# EAGLE design PAYLOAD (EAGLE 9.6.2)
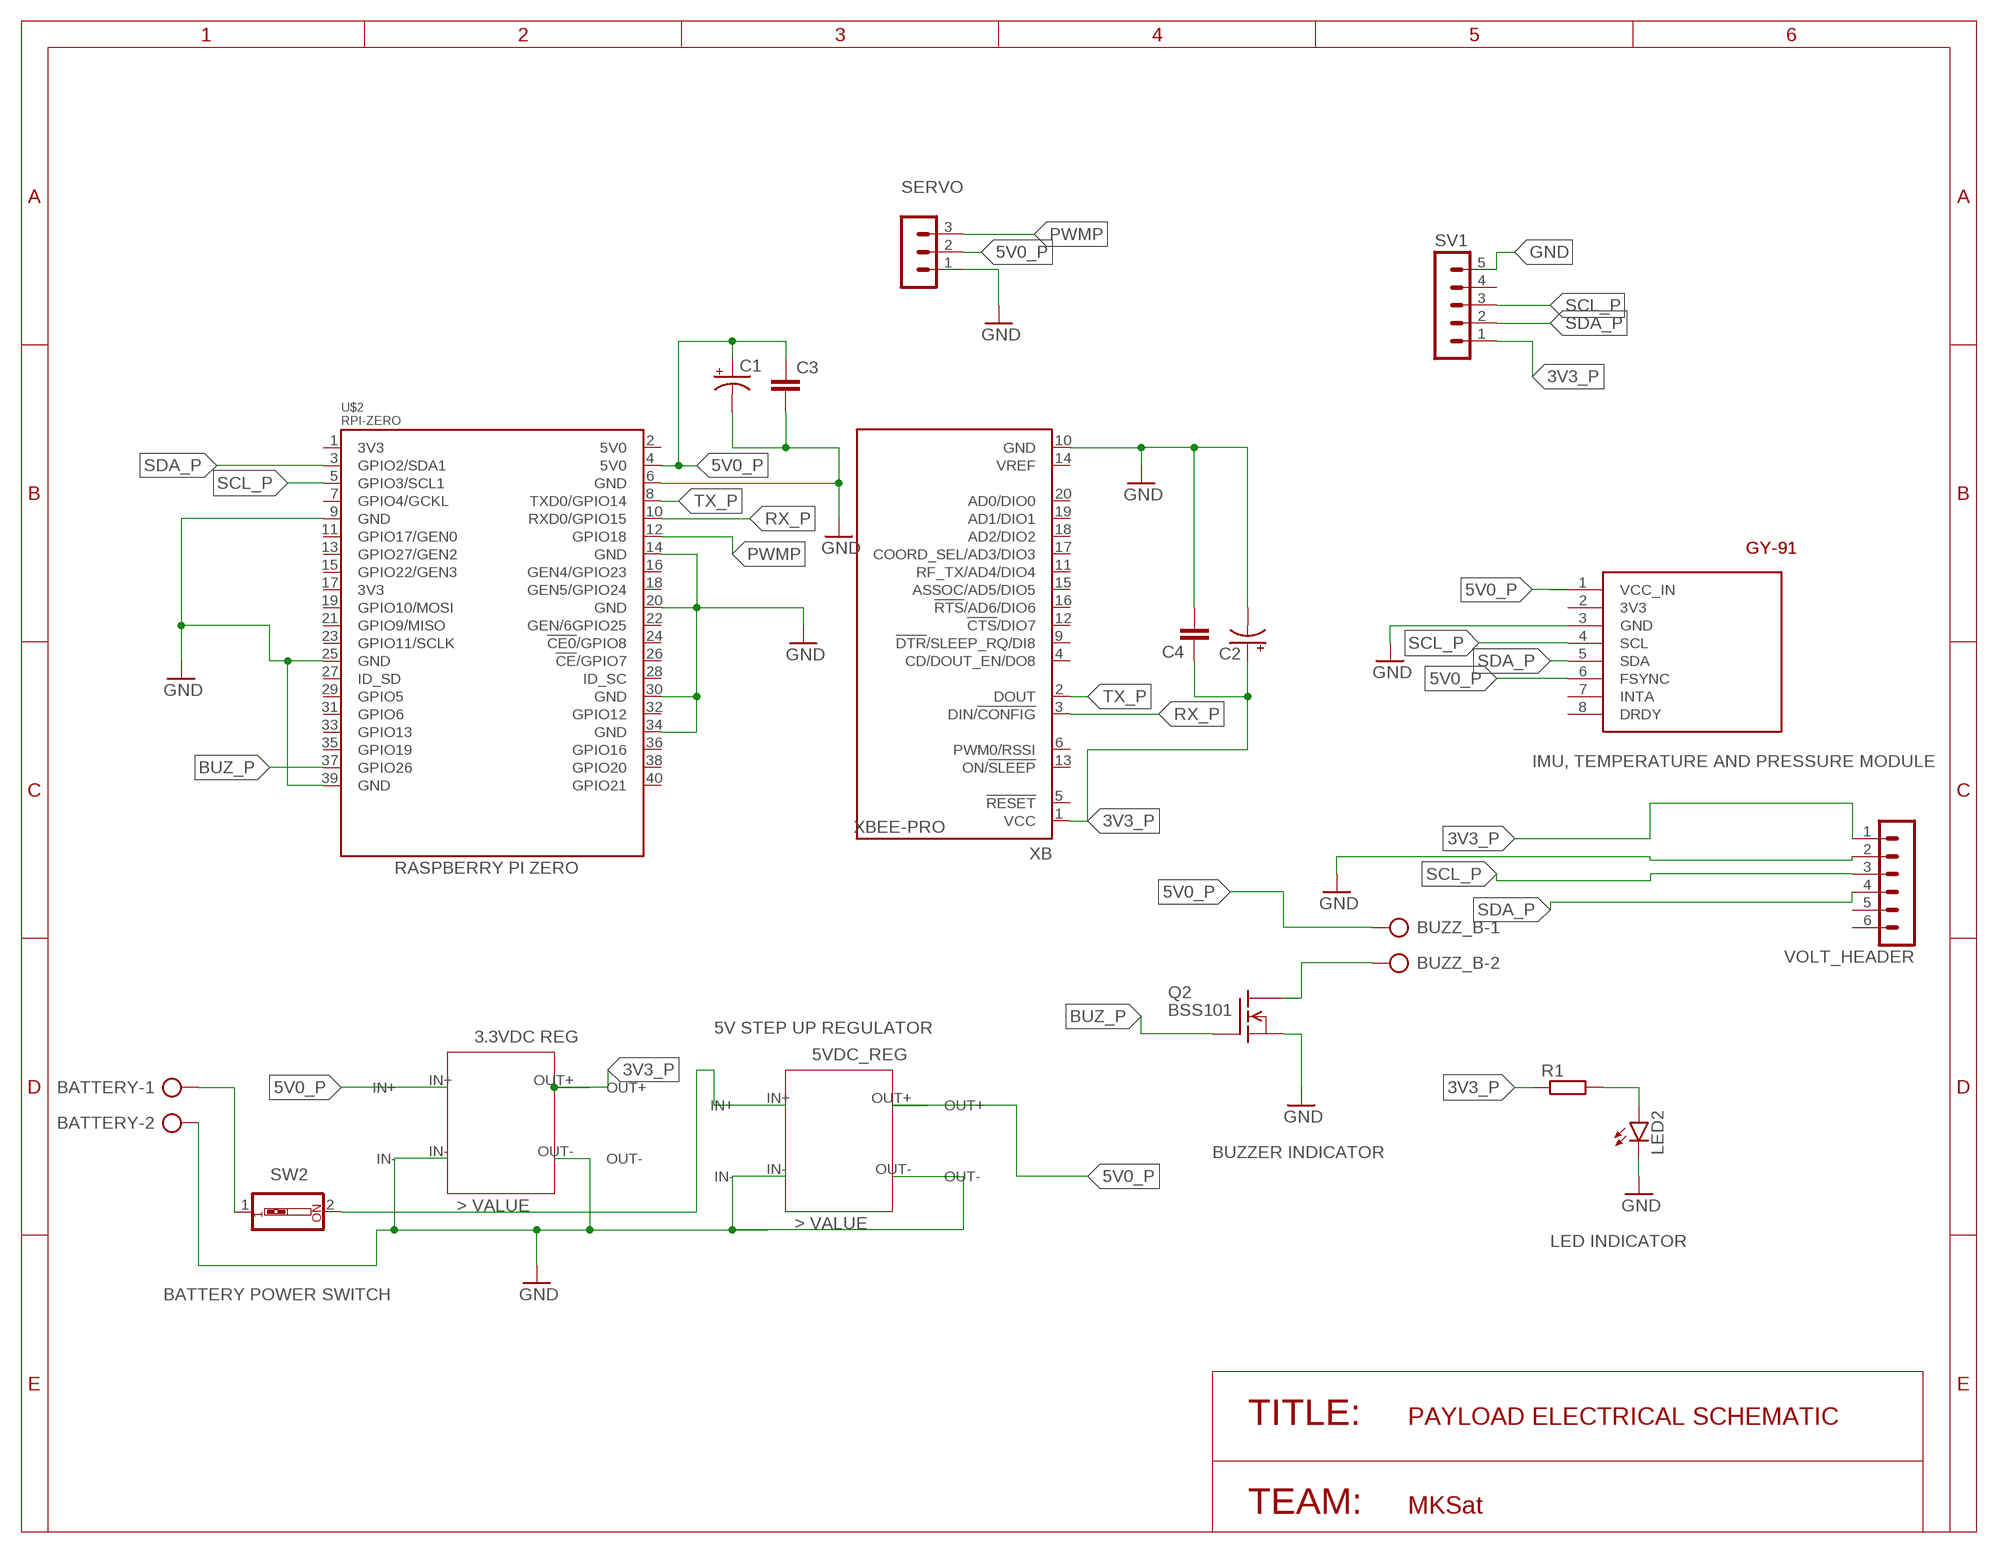
[diagram p0: schematic, sheet 1]

## Parts
BATTERY  AK500/2  [AK500/2]
BUZZ_B  AK500/2  [AK500/2]
C1  CPOL-USTAP5-45  [TAP5-45]
C2  CPOL-USTAP5-45  [TAP5-45]
C3  C-EU050-030X075  [C050-030X075]
C4  C-EU050-030X075  [C050-030X075]
GY-91_P  GY-86  [GY-86]
LED2  LED5MM  [LED5MM]
Q2  BSS101  [TO92]
R1  R-EU_0207/12  [0207/12]
SERVO  MA03-1  [MA03-1]
SV1  MA05-1  [MA05-1]
SW2  SW_DIP-1  [EDG-01]
U$1  3VDC_REG  [3VDC_REG]
U$2  RPI-ZERO  [RASPBERRYPI_BASTELSTUBE_V13_RASPI_BOARD_B+_FULL]
U$3  5VDC_REG  [5VDC_REG]
VOLT_HEADER  MA06-1  [MA06-1]
XB  XBEE-PRO  [XBEE-PRO]

## Nets
3V3_P: C2.+ C4.1 R1.1 SV1.1 U$1.OUT+ VOLT_HEADER.1 XB.1(VCC)
5V0_P: BUZZ_B.1 C1.+ C3.1 GY-91_P.1(VCC_IN) GY-91_P.6(FSYNC) SERVO.2 U$1.IN+ U$2.4(5V0) U$3.OUT+
BUZ_P: Q2.2(G) U$2.37(GPIO26)
GND: BATTERY.2 C1.- C2.- C3.2 C4.2 GY-91_P.3(GND) LED2.K(C) Q2.1(S) SERVO.1 SV1.5 U$1.IN- U$1.OUT- U$2.6(GND) U$2.9(GND) U$2.14(GND) U$2.20(GND) U$2.25(GND) U$2.30(GND) U$2.34(GND) U$2.39(GND) U$3.IN- U$3.OUT- VOLT_HEADER.2 XB.10(GND)
N$1: BUZZ_B.2 Q2.3(D)
N$2: SW2.2 U$3.IN+
N$3: BATTERY.1 SW2.1
N$11: LED2.A R1.2
PWMP: SERVO.3 U$2.12(GPIO18)
RX_P: U$2.10(RXD0/GPIO15) XB.3(DIN/!CONFIG)
SCL_P: GY-91_P.4(SCL) SV1.3 U$2.5(GPIO3/SCL1) VOLT_HEADER.3
SDA_P: GY-91_P.5(SDA) SV1.2 U$2.3(GPIO2/SDA1) VOLT_HEADER.4
TX_P: U$2.8(TXD0/GPIO14) XB.2(DOUT)
Unconnected: GY-91_P.2(3V3) GY-91_P.7(INTA) GY-91_P.8(DRDY) SV1.4 U$2.1(3V3) U$2.2(5V0) U$2.7(GPIO4/GCKL) U$2.11(GPIO17/GEN0) U$2.13(GPIO27/GEN2) U$2.15(GPIO22/GEN3) U$2.16(GEN4/GPIO23) U$2.17(3V3) U$2.18(GEN5/GPIO24) U$2.19(GPIO10/MOSI) U$2.21(GPIO9/MISO) U$2.22(GEN/6GPIO25) U$2.23(GPIO11/SCLK) U$2.24(!CE0!/GPIO8) U$2.26(!CE!/GPIO7) U$2.27(ID_SD) U$2.28(ID_SC) U$2.29(GPIO5) U$2.31(GPIO6) U$2.32(GPIO12) U$2.33(GPIO13) U$2.35(GPIO19) U$2.36(GPIO16) U$2.38(GPIO20) U$2.40(GPIO21) VOLT_HEADER.5 VOLT_HEADER.6 XB.4(CD/DOUT_EN/DO8) XB.5(!RESET) XB.6(PWM0/RSSI) XB.9(!DTR!/SLEEP_RQ/DI8) XB.11(RF_TX/AD4/DIO4) XB.12(!CTS!/DIO7) XB.13(ON/!SLEEP) XB.14(VREF) XB.15(ASSOC/AD5/DIO5) XB.16(!RTS!/AD6/DIO6) XB.17(COORD_SEL/AD3/DIO3) XB.18(AD2/DIO2) XB.19(AD1/DIO1) XB.20(AD0/DIO0)

## Notes on the sheet
- GY-91 | GY-91
- IMU, TEMPERATURE AND PRESSURE MODULE
- RASPBERRY PI ZERO
- 5V STEP UP REGULATOR
- BUZZER INDICATOR
- LED INDICATOR
- BATTERY POWER SWITCH
- TITLE: | PAYLOAD ELECTRICAL SCHEMATIC
- TEAM: | MKSat

## Library data of the parts
BATTERY BUZZ_B = con-ptr500:AK500/2: CONNECTOR; OC_FARNELL: unknown; OC_NEWARK: unknown
C1 C2 = rcl:CPOL-US: POLARIZED CAPACITOR, American symbol; SPICEPREFIX: C
C3 C4 = rcl:C-EU: CAPACITOR, European symbol; SPICEPREFIX: C
GY-91_P = GY_Boards:GY-86
LED2 = led:LED: LED OSRAM: - CHIPLED LG R971, LG N971, LY N971, LG Q971, LY Q971, LO R971, LY R971 LH N974, LH R974 LS Q976, LO Q976, LY Q976 LO Q996 - Hyper CHIPLED LW Q18S LB Q993, LB Q99A, LB R99A - SideLED LS A670, LO A670, LY A670, LG A670, LP A670 LB A673, LV A673, LT A673, LW A673 LH A674 LY A675 LS A676, LA A676, LO A676, LY A676, LW A676 LS A679, LY A679, LG A679 - Hyper Micro SIDELED® LS Y876, LA Y876, LO Y876, LY Y876 LT Y87S - SmartLED LW L88C, LW L88S LB L89C, LB L89S, LG L890 LS L89K, LO L89K, LY L89K LS L896, LA L896, LO L896, LY L896 - TOPLED LS T670, LO T670, LY T670, LG T670, LP T670 LSG T670, LSP T670, LSY T670, LOP T670, LYG T670 LG T671, LOG T671, LSG T671 LB T673, LV T673, LT T673, LW T673 LH T674 LS T676, LA T676, LO T676, LY T676, LB T676, LH T676, LSB T676, LW T676 LB T67C, LV T67C, LT T67C, LS T67K, LO T67K, LY T67K, LW E67C LS E67B, LA E67B, LO E67B, LY E67B, LB E67C, LV E67C, LT E67C LW T67C LS T679, LY T679, LG T679 LS T770, LO T770, LY T770, LG T770, LP T770 LB T773, LV T773, LT T773, LW T773 LH T774 LS E675, LA E675, LY E675, LS T675 LS T776, LA T776, LO T776, LY T776, LB T776 LHGB T686 LT T68C, LB T68C - Hyper Mini TOPLED® LB M676 - Mini TOPLED Santana® LG M470 LS M47K, LO M47K, LY M47K Source: http://www.osram.convergy.de LUXEON: - LUMILED® LXK2-PW12-R00, LXK2-PW12-S00, LXK2-PW14-U00, LXK2-PW14-V00 LXK2-PM12-R00, LXK2-PM12-S00, LXK2-PM14-U00 LXK2-PE12-Q00, LXK2-PE12-R00, LXK2-PE12-S00, LXK2-PE14-T00, LXK2-PE14-U00 LXK2-PB12-K00, LXK2-PB12-L00, LXK2-PB12-M00, LXK2-PB14-N00, LXK2-PB14-P00, LXK2-PB14-Q00 LXK2-PR12-L00, LXK2-PR12-M00, LXK2-PR14-Q00, LXK2-PR14-R00 LXK2-PD12-Q00, LXK2-PD12-R00, LXK2-PD12-S00 LXK2-PH12-R00, LXK2-PH12-S00 LXK2-PL12-P00, LXK2-PL12-Q00, LXK2-PL12-R00 Source: www.luxeon.com KINGBRIGHT: KA-3528ASYC Source: www.kingbright.com
Q2 = transistor-fet:BSS101: N-Channel Enhancement MOSFET 200V; 0,16A; 11Ohm
R1 = rcl:R-EU_: RESISTOR, European symbol; SPICEPREFIX: R
SERVO = con-lstb:MA03-1: PIN HEADER; OC_FARNELL: unknown; OC_NEWARK: unknown
SV1 = con-lstb:MA05-1: PIN HEADER; OC_FARNELL: unknown; OC_NEWARK: unknown
SW2 = special:SW_DIP-1: DIP SWITCH
U$1 = VOLTAGE_REGULATORS_CANSAT:3VDC_REG
U$2 = RPI-Zero:RPI-ZERO
U$3 = VOLTAGE_REGULATORS_CANSAT:5VDC_REG
VOLT_HEADER = con-lstb:MA06-1: PIN HEADER; OC_FARNELL: unknown; OC_NEWARK: unknown
XB = maxstream:XBEE: XBee (TM) /XBee-PRO(TM) OEM RF Modules Source: MaxStream, Inc. xbee_productmanual.pdf; MPN: XBP24-AWI-001; OC_FARNELL: 1337916; OC_NEWARK: 42M2667

## Board
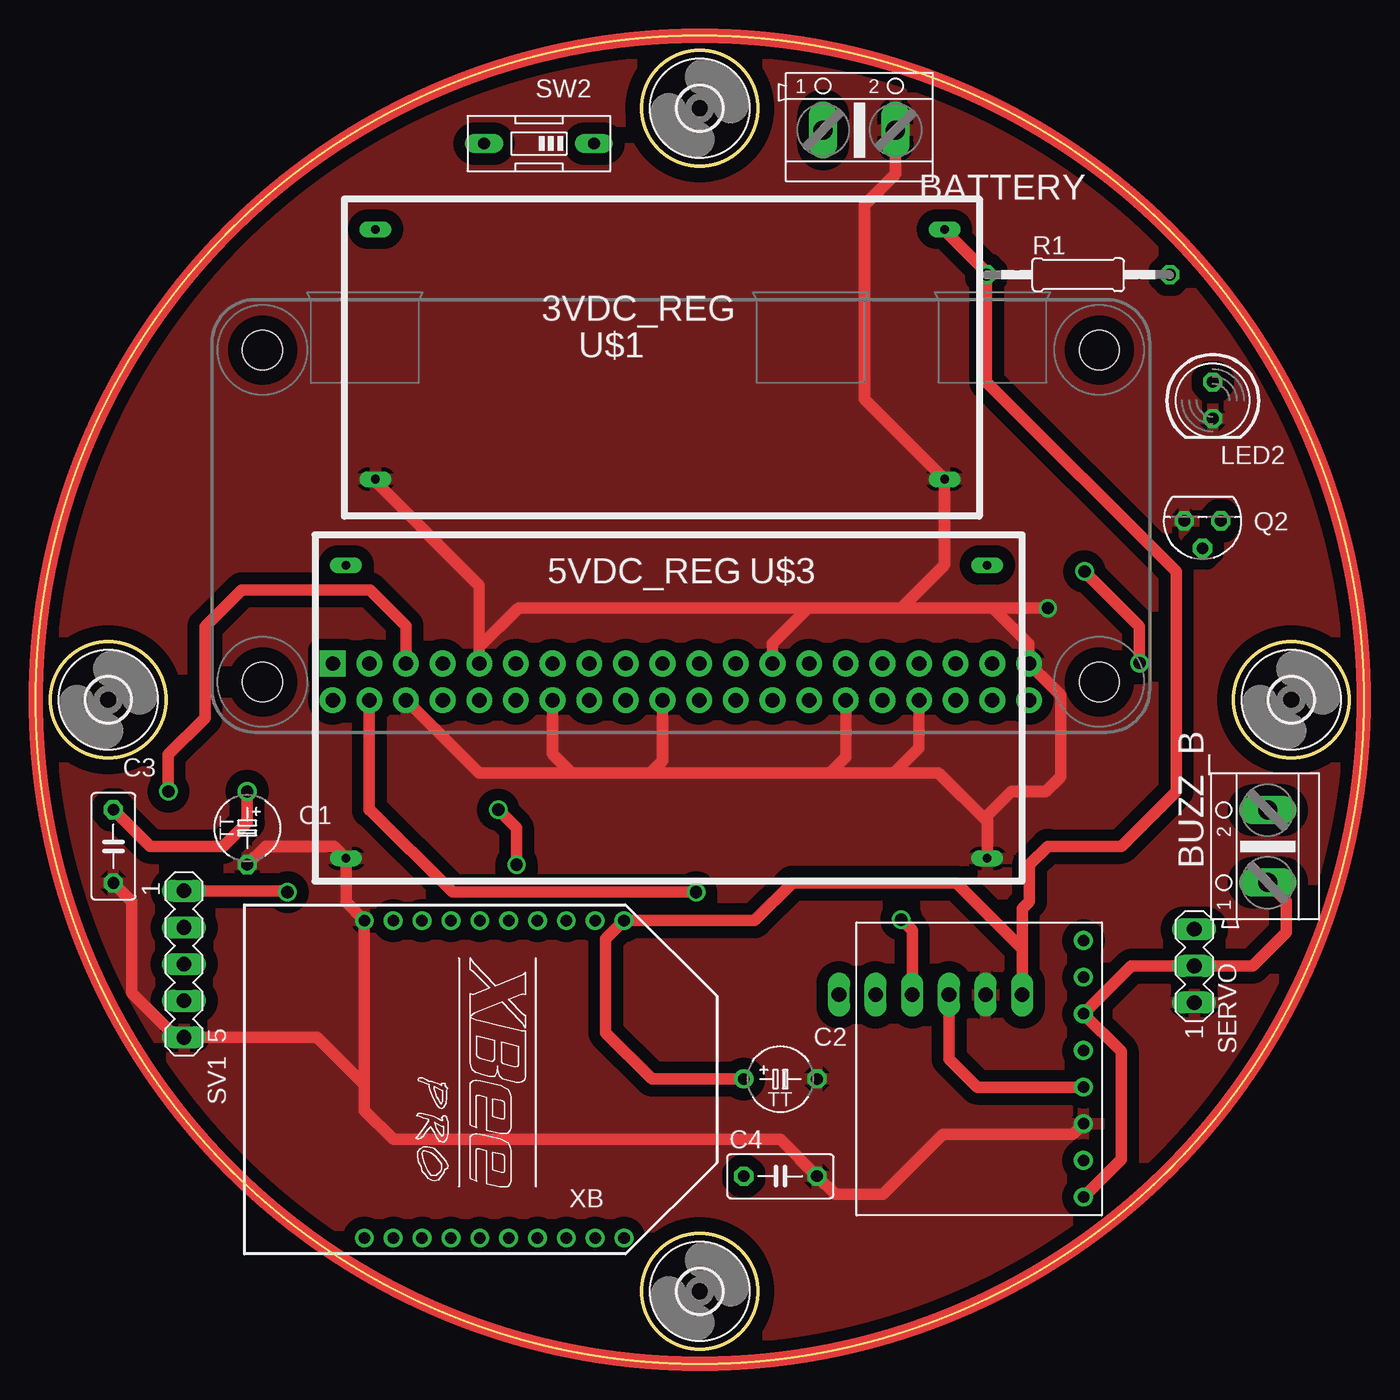
[diagram p1: board, top side]
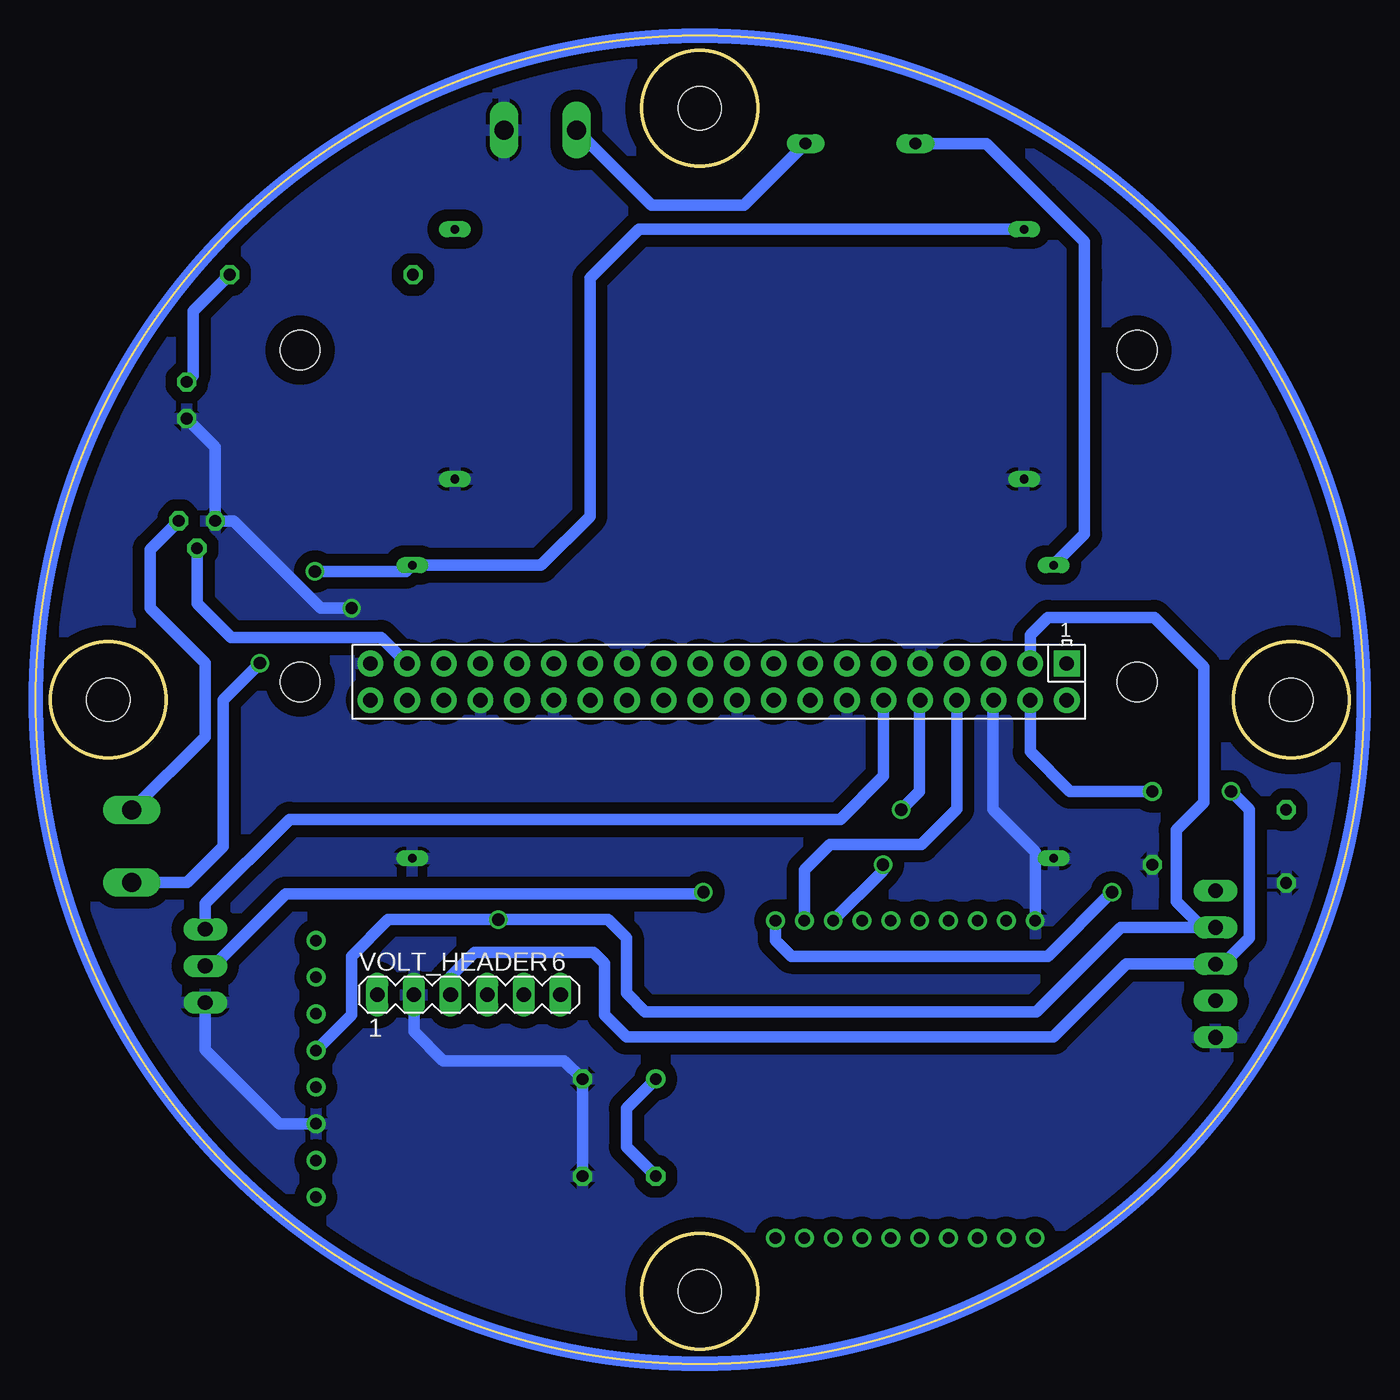
[diagram p2: board, bottom side, seen from below]

Size 92 x 92 mm. Coordinates in mm from the lower left corner, seen from the top.
Outline: circle at 46,46 radius 46
Outline: circle at 87,46 radius 4
Outline: circle at 46,87 radius 4
Outline: circle at 46,5 radius 4
Outline: circle at 5,46 radius 4
Copper layers (1*16): Top 0.035mm / dielectric 1.5mm / Bottom 0.035mm
Design rules "default *": minimum track width 6mil, minimum drill 0.35mm, track to track 12mil, track to pad 12mil, pad to pad 12mil, via to via 12mil, smd to smd 12mil, copper to edge 40mil, drill to drill 6mil, minimum pad ring 10mil, minimum via ring 8mil, stop-mask expansion 4mil, vias tented up to drill 0mil, thermal gap 10mil

### Footprints (pad centres in the part's own frame; a part is rotated, then mirrored left to right if it is on the bottom)
AK500/2 = drill 1.321 long: 1 -2.515,0; 2 2.515,0
TAP5-45 = drill 0.813: + -2.54,0 | drill 0.813 octagon: - 2.54,0
C050-030X075 = drill 0.813 octagon: 1 -2.54,0; 2 2.54,0
GY-86 = drill 0.8: 1 1.27,19.05; 2 1.27,16.51; 3 1.27,13.97; 4 1.27,11.43; 5 1.27,8.89; 6 1.27,6.35; 7 1.27,3.81; 8 1.27,1.27
3,0 = hole 3: 0,0
LED5MM = drill 0.813 octagon: A -1.27,0; K 1.27,0
TO92 = drill 0.813 octagon: 1 1.27,0; 2 0,1.905; 3 -1.27,0
0207/12 = drill 0.813 octagon: 1 -6.35,0; 2 6.35,0
MA03-1 = drill 1.016 long: 1 -2.54,0; 2 0,0; 3 2.54,0
MA05-1 = drill 1.016 long: 1 -5.08,0; 2 -2.54,0; 3 0,0; 4 2.54,0; 5 5.08,0
EDG-01 = drill 0.813 long: 1 0,-3.81; 2 0,3.81
3VDC_REG = drill 0.6 long: IN+ -17.86,8.89; IN- -17.86,-8.43; OUT+ 21.59,8.89; OUT- 21.59,-8.43
RASPBERRYPI_BASTELSTUBE_V13_RASPI_BOARD_B+_FULL = drill 1 pad 1.778 square: 1 8.37,25.23 | drill 1 pad 1.778: 2 8.37,27.77; 3 10.91,25.23; 4 10.91,27.77; 5 13.45,25.23; 6 13.45,27.77; 7 15.99,25.23; 8 15.99,27.77; 9 18.53,25.23; 10 18.53,27.77; 11 21.07,25.23; 12 21.07,27.77; 13 23.61,25.23; 14 23.61,27.77; 15 26.15,25.23; 16 26.15,27.77; 17 28.69,25.23; 18 28.69,27.77; 19 31.23,25.23; 20 31.23,27.77; 21 33.77,25.23; 22 33.77,27.77; 23 36.31,25.23; 24 36.31,27.77; 25 38.85,25.23; 26 38.85,27.77; 27 41.39,25.23; 28 41.39,27.77; 29 43.93,25.23; 30 43.93,27.77; 31 46.47,25.23; 32 46.47,27.77; 33 49.01,25.23; 34 49.01,27.77; 35 51.55,25.23; 36 51.55,27.77; 37 54.09,25.23; 38 54.09,27.77; 39 56.63,25.23; 40 56.63,27.77 | hole 2.75: 3.5,3.5; 3.5,26.5; 61.5,3.5; 61.5,26.5
5VDC_REG = drill 0.6 long: IN+ -22.86,8.89; IN- -22.86,-11.43; OUT+ 21.59,8.89; OUT- 21.59,-11.43
MA06-1 = drill 1.016 long: 1 -6.35,0; 2 -3.81,0; 3 -1.27,0; 4 1.27,0; 5 3.81,0; 6 6.35,0
XBEE-PRO = drill 0.8 pad 1.27: 1 -11,9; 2 -11,7; 3 -11,5; 4 -11,3; 5 -11,1; 6 -11,-1; 7 -11,-3; 8 -11,-5; 9 -11,-7; 10 -11,-9; 11 11,-9; 12 11,-7; 13 11,-5; 14 11,-3; 15 11,-1; 16 11,1; 17 11,3; 18 11,5; 19 11,7; 20 11,9

### Placement (x,y rotation side)
BATTERY  57.06,85.49 0 top
BUZZ_B  85.37,35.84 90 top
C1  14.63,37.11 270 top
C2  51.59,19.71 0 top
C3  5.36,35.84 270 top
C4  51.59,12.98 0 top
GY-91_P  73.87,30.58 180 top
H1  MOUNT-HOLE3.0  [3,0]  46,87 0 top
H2  MOUNT-HOLE3.0  [3,0]  87,46 0 top
H3  MOUNT-HOLE3.0  [3,0]  5,46 0 top
H4  MOUNT-HOLE3.0  [3,0]  46,5 0 top
LED2  81.56,66.76 270 top
Q2  80.85,58.4 180 top
R1  72.23,75.46 0 top
SERVO  80.27,27.55 90 top
SV1  10.25,27.68 270 top
SW2  34.86,84.55 90 top
U$1  41.38,69.72 0 top
U$2  12.19,73.74 180 bottom
U$3  44.33,46.44 0 top
VOLT_HEADER  62,25.55 0 bottom
XB  31.75,19.69 270 top

### Tracks (layer width: path | path; a pad name or v marks a point on that pad's centre or on a via)
3V3_P  (via drill 0.85)
  Top 0.813: U$1.OUT+ 62.97,78.56 65.88,75.65 R1.1 65.88,68.03 79.02,54.89 79.02,39.65 75.21,35.84 70.13,35.84 68.86,34.57 68.86,32.03 68.35,31.52 VOLT_HEADER.1 68.35,28.73 63.78,33.3 52.42,33.3 49.81,30.69 XB.1 39.48,29.42 39.48,22.93 42.7,19.71 C2.+ | v17.43,32.66 17.33,32.76 SV1.1
  Bottom 0.813: XB.1 40.75,29.32 39.65,28.22 21.87,28.22 v17.43,32.66 | C2.+ 51.08,17.68 51.08,15.01 C4.1
5V0_P  (via drill 0.85)
  Top 0.813: BUZZ_B.1 86.64,32.05 86.64,29.87 84.32,27.55 SERVO.2 75.92,27.55 GY-91_P.6 75.21,21.62 75.21,14.14 GY-91_P.1 | v72.67,54.89 76.48,51.08 v76.48,48.54 | v45.75,32.66 28.86,32.66 23.14,38.38 23.1,38.35 U$2.4 | C3.1 7.9,35.84 12.98,35.84 14.63,37.49 C1.+
  Bottom 0.813: SERVO.2 79.69,27.55 74.7,32.54 45.87,32.54 v45.75,32.66 | v72.67,54.89 66.36,54.89 U$3.OUT+ 56.99,55.33 53.62,58.7 53.62,75.21 50.22,78.61 U$1.IN+ | BUZZ_B.1 81.53,33.33 79.02,35.84 79.02,46 v76.48,48.54 | C1.+ 20.35,39.65 23.1,42.4 U$2.4
BUZ_P
  Bottom 0.813: U$2.37 68.09,50.32 78.49,50.32 80.85,52.69 Q2.2
GND  (via drill 0.85)
  Top 0.813: 22.75,19.33 XB.10 21.47,31.97 U$3.IN- 20.64,35.84 15.9,35.84 C1.- | 22.75,19.33 22.75,17.56 24.79,15.52 51.59,15.52 C4.2 55.4,11.71 58.7,11.71 62.86,15.87 71.86,15.87 GY-91_P.3 | 53.49,52.35 33.43,52.35 30.72,49.64 | 30.72,49.64 U$2.9 | U$2.25 51.04,49.9 53.49,52.35 | 30.72,49.64 30.72,53.91 23.52,61.11 U$1.IN- | BATTERY.2 59.58,82.44 57.43,80.29 57.43,66.83 U$1.OUT- 62.97,55.35 59.97,52.35 | 53.49,52.35 59.97,52.35 | 59.97,52.35 66.32,52.35 | 66.32,52.35 v70.13,52.35 | 66.32,52.35 68.82,49.85 U$2.39 71.02,46.31 71.02,40.67 70,39.65 67.59,39.65 65.92,37.98 65.92,37.55 | U$2.6 30.69,40.92 37.11,40.92 | 37.11,40.92 42.57,40.92 | U$3.OUT- 65.92,37.55 | 65.92,37.55 62.55,40.92 59.46,40.92 | 59.46,40.92 55.02,40.92 | 55.02,40.92 42.57,40.92 | 42.57,40.92 43.42,41.77 U$2.20 | U$2.30 56.12,42.02 55.02,40.92 | U$2.34 61.2,42.66 59.46,40.92 | 37.11,40.92 35.8,42.23 U$2.14 | C3.2 6.63,32.03 6.63,25.68 9.71,22.6 SV1.5 19.48,22.6 22.75,19.33
  Bottom 0.813: SERVO.1 80.27,21.74 75.14,16.61 GY-91_P.3 | v70.13,52.35 72.26,52.35 78.31,58.4 Q2.1 79.58,63.51 LED2.K | U$2.6 25.68,45.93 25.68,38.38 22.75,35.45 XB.10 | C4.2 54.32,13.17 54.13,13.36 C2.- 55.4,20.98 63.78,20.98 65.81,23.01 VOLT_HEADER.2
  pour Bottom (isolate 0.813): -2.26,98.07 96.8,98.07 96.8,76.48 96.8,-4.8 -2.26,-4.8
  pour Top (isolate 0.813): -12.48,95.53 95.53,95.53 95.53,-6.07 -7.34,-6.07
N$1
  Bottom 0.813: Q2.3 84.1,56.42 84.1,52.35 80.29,48.54 80.29,43.44 BUZZ_B.2
N$2
  Bottom 0.813: SW2.2 26.13,84.55 23.14,81.56 22.25,80.67 19.33,77.75 19.33,75.69 19.33,75.21 19.33,57.47 U$3.IN+
N$3
  Bottom 0.813: BATTERY.1 49.34,80.29 42.93,80.29 SW2.1
N$11
  Bottom 0.813: R1.2 81.12,72.92 81.12,68.47 LED2.A
PWMP
  Bottom 0.813: SERVO.3 80.27,31.87 74.43,37.71 36.25,37.71 33.26,40.71 U$2.12
RX_P  (via drill 0.85)
  Top 0.813: v32.03,38.38 33.3,37.11 v33.3,34.57
  Bottom 0.813: XB.3 33.3,34.14 v33.3,34.57 | U$2.10 30.76,45.93 30.76,39.65 v32.03,38.38
SCL_P  (via drill 0.85)
  Top 0.813: U$2.5 25.64,51.12 23.14,53.62 14.25,53.62 11.71,51.08 11.71,44.73 9.17,42.19 v9.17,39.65 | VOLT_HEADER.3 63.27,21.11 65.23,19.15 GY-91_P.4
  Bottom 0.813: v9.17,39.65 7.9,38.38 7.9,29.49 9.71,27.68 SV1.3 16.44,27.68 21.49,22.63 51.08,22.63 52.6,24.16 52.6,27.71 53.37,28.47 61.62,28.47 63.27,26.82 VOLT_HEADER.3
SDA_P  (via drill 0.85)
  Top 0.813: VOLT_HEADER.4 60.73,30 v59.97,30.76
  Bottom 0.813: U$2.3 23.1,50.48 21.87,51.72 14.5,51.72 11.08,48.29 11.08,38.89 12.98,36.98 12.98,32.03 11.17,30.22 SV1.2 16.82,30.22 22.66,24.38 49.78,24.38 51.08,25.68 51.08,29.49 52.35,30.76 v59.97,30.76 67.59,30.76 70.13,28.22 70.13,24.16 GY-91_P.5
TX_P
  Bottom 0.813: XB.2 38.75,34.2 36.98,35.97 30.63,35.97 28.18,38.42 U$2.8
(copper drawn outside any net)
  shapes: Bottom circle x1, Top circle x1